# Altium schematic sheet 02.Function_Diagram.SchDoc
size A4; CheckedBy: YPC; DocumentNumber: 2; Revision: V1.00; SheetNumber: 02; SheetTotal: 18; SheetName: Function_Diagram; SheetDescribe: SheetDescribe; Designer: JOW; DesignDate: 2025-04-25; CheckedData: 2025-04-25; Rule: PcbType=ProtelPcb
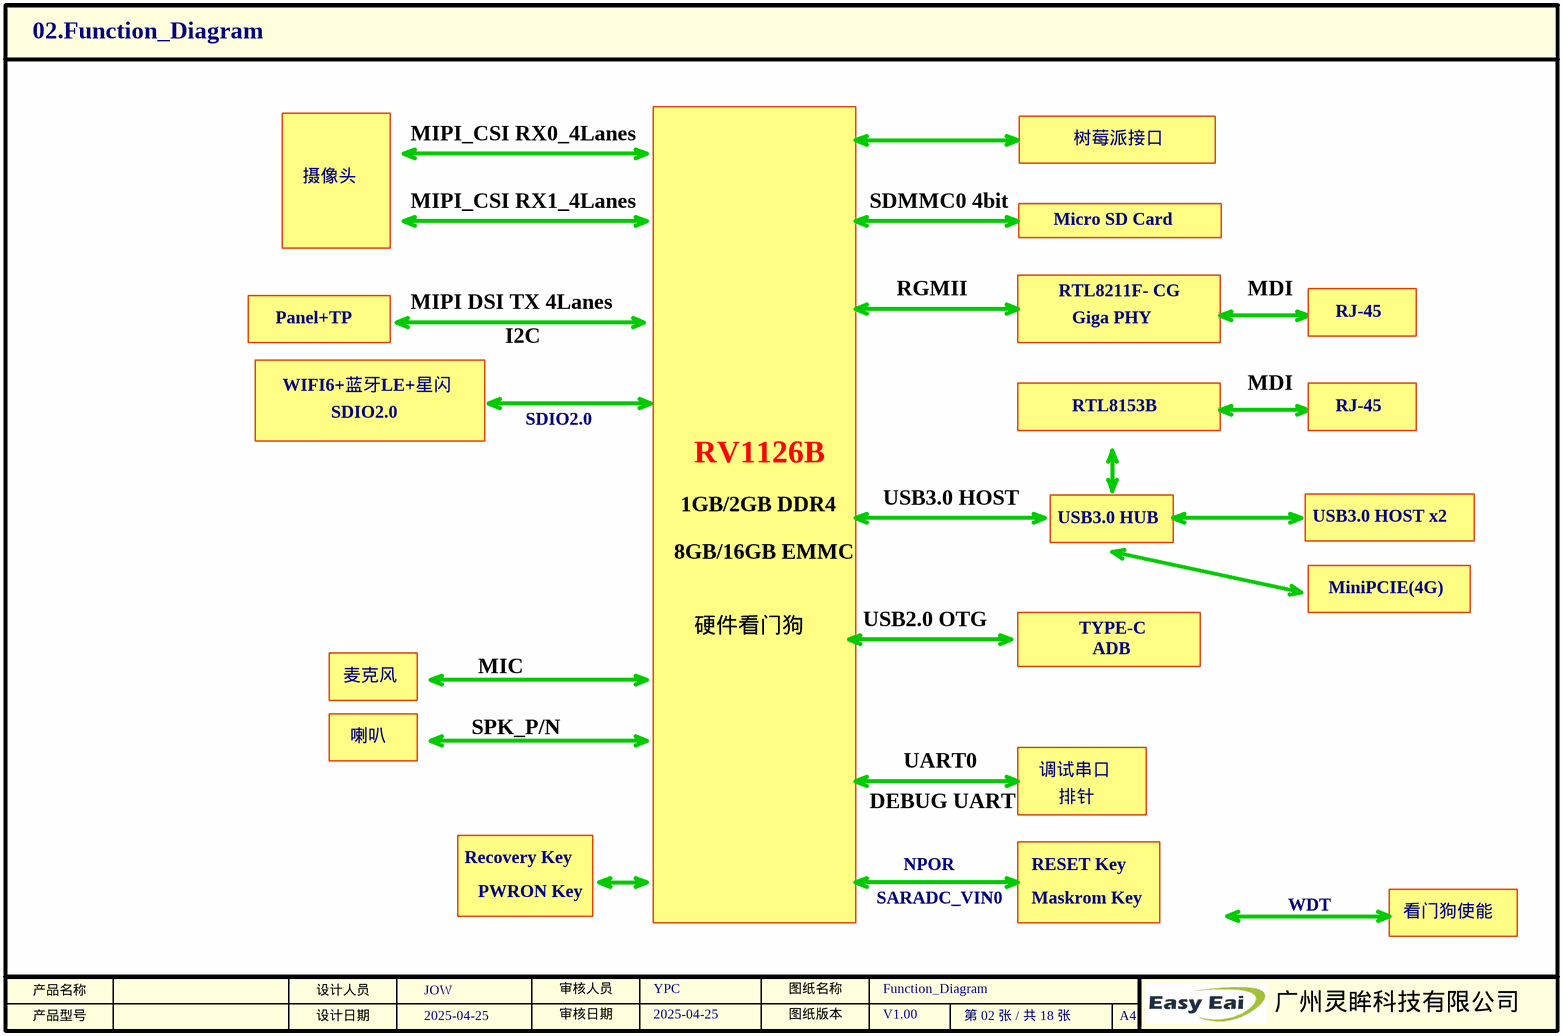
[diagram p0: 02.Function_Diagram.SchDoc]

## Notes on the sheet
- MIPI_CSI RX0_4Lanes
- 树莓派接口
- 摄像头
- MIPI_CSI RX1_4Lanes
- SDMMC0 4bit
- Micro SD Card
- MIPI DSI TX 4Lanes
- RGMII
- RTL8211F- CG
- MDI
- Panel+TP
- I2C
- Giga PHY
- RJ-45
- WIFI6+蓝牙LE+星闪
- SDIO2.0
- RTL8153B
- 1GB/2GB DDR4
- RV1126B
- USB3.0 HOST
- 8GB/16GB EMMC
- USB3.0 HUB
- USB3.0 HOST x2
- 硬件看门狗
- USB2.0 OTG
- TYPE-C
- ADB
- MiniPCIE(4G)
- 麦克风
- MIC
- 喇叭
- SPK_P/N
- UART0
- 调试串口
- DEBUG UART
- 排针
- Recovery Key
- PWRON Key
- SARADC_VIN0
- NPOR
- RESET Key
- Maskrom Key
- WDT
- 看门狗使能
- 产品名称
- 产品型号
- 设计人员
- 设计日期
- 审核人员
- 审核日期
- 图纸版本
- 图纸名称
- A4
- 广州灵眸科技有限公司